# EAGLE schematic wear_fixture_board (EAGLE 9.1.3)
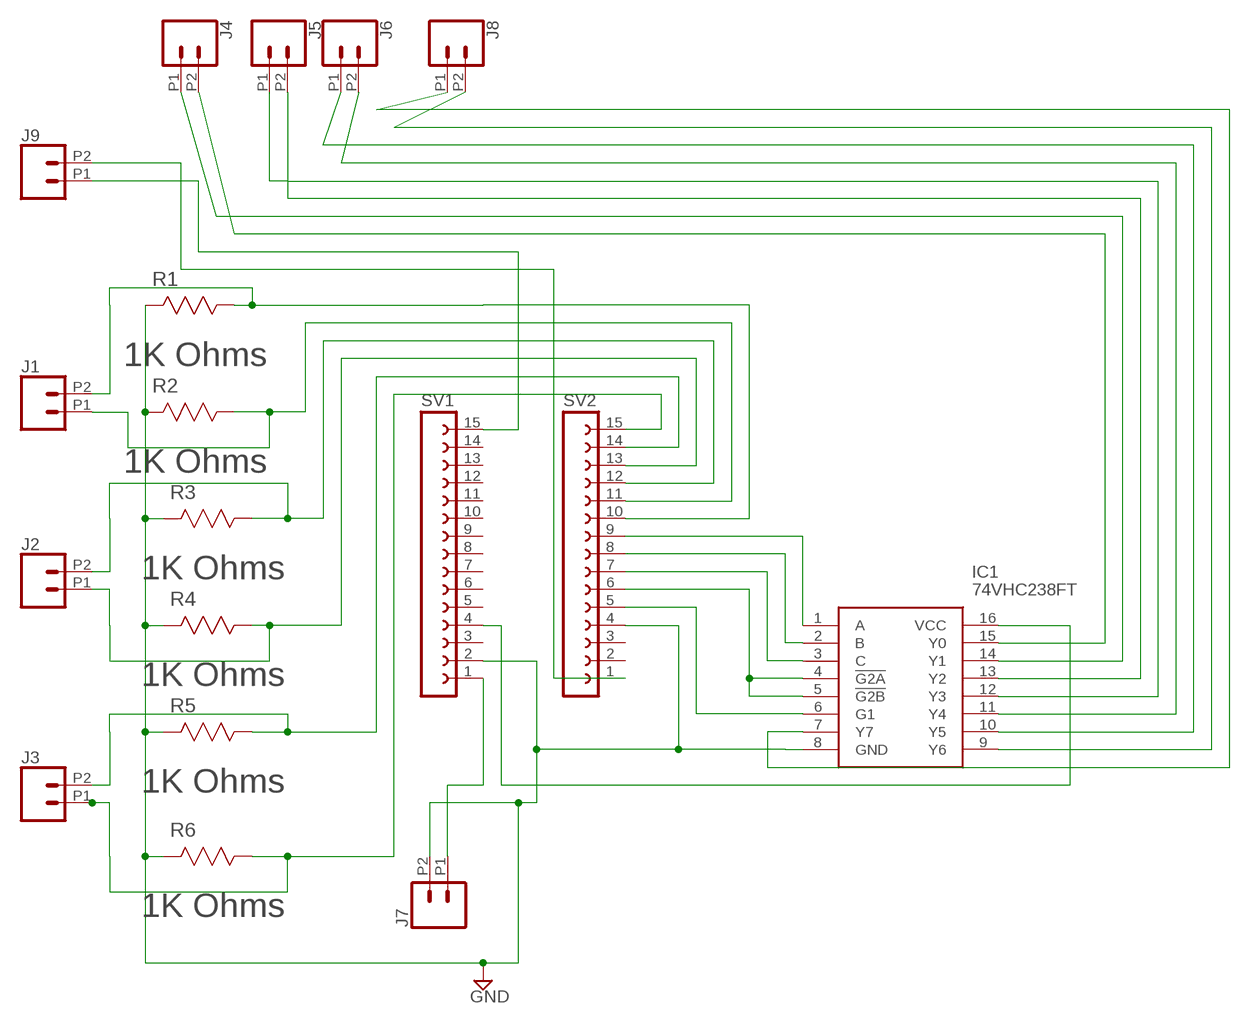
[diagram p0: schematic, sheet 1]

## Parts
IC1  74VHC238FT  [SOP65P640X120-16N]
J1  CONN_022.54MM_SCREWTERM  [1X02_2.54_SCREWTERM]
J2  CONN_022.54MM_SCREWTERM  [1X02_2.54_SCREWTERM]
J3  CONN_022.54MM_SCREWTERM  [1X02_2.54_SCREWTERM]
J4  CONN_022.54MM_SCREWTERM  [1X02_2.54_SCREWTERM]
J5  CONN_022.54MM_SCREWTERM  [1X02_2.54_SCREWTERM]
J6  CONN_022.54MM_SCREWTERM  [1X02_2.54_SCREWTERM]
J7  CONN_022.54MM_SCREWTERM  [1X02_2.54_SCREWTERM]
J8  CONN_022.54MM_SCREWTERM  [1X02_2.54_SCREWTERM]
J9  CONN_022.54MM_SCREWTERM  [1X02_2.54_SCREWTERM]
R1  1K Ohms  CRCW12061K00FKEA  [RESC3216X71N]
R2  1K Ohms  CRCW12061K00FKEA  [RESC3216X71N]
R3  1K Ohms  CRCW12061K00FKEA  [RESC3216X71N]
R4  1K Ohms  CRCW12061K00FKEA  [RESC3216X71N]
R5  1K Ohms  CRCW12061K00FKEA  [RESC3216X71N]
R6  1K Ohms  CRCW12061K00FKEA  [RESC3216X71N]
SV1  FE15-1  [FE15]
SV2  FE15-1  [FE15]

## Nets
GND: IC1.8(GND) J7.P2 R1.2 R2.2 R3.2 R4.2 R5.2 R6.2 SV1.2 SV2.4
N$1: J3.P1 R6.1 SV2.15
N$2: J1.P2 R1.1 SV2.10
N$3: J2.P2 R3.1 SV2.12
N$4: J2.P1 R4.1 SV2.13
N$5: J3.P2 R5.1 SV2.14
N$11: J1.P1 R2.1 SV2.11
N$12: IC1.1(A) SV2.9
N$13: IC1.2(B) SV2.8
N$14: IC1.3(C) SV2.7
N$15: IC1.4(!G2A) IC1.5(!G2B) SV2.6
N$16: IC1.11(Y4) J6.P2
N$17: IC1.6(G1) SV2.5
N$18: IC1.16(VCC) SV1.4
N$19: IC1.10(Y5) J6.P1
N$20: IC1.15(Y0) J4.P2
N$21: IC1.14(Y1) J4.P1
N$22: IC1.13(Y2) J5.P2
N$23: IC1.12(Y3) J5.P1
N$24: IC1.9(Y6) J8.P2
N$25: IC1.7(Y7) J8.P1
N$26: J9.P2 SV2.1
N$27: J9.P1 SV1.15
N$28: J7.P1 SV1.1
Unconnected: SV1.3 SV1.5 SV1.6 SV1.7 SV1.8 SV1.9 SV1.10 SV1.11 SV1.12 SV1.13 SV1.14 SV2.2 SV2.3

## Library data of the parts
IC1 = SamacSys_Parts:74VHC238FT: Encoders, Decoders, Multiplexers & Demultiplexers CMOS Logic IC 5.5ns 8mA 2.0V-5.5V Source: Datasheet; DESCRIPTION: Encoders, Decoders, Multiplexers & Demultiplexers CMOS Logic IC 5.5ns 8mA 2.0V-5.5V; HEIGHT: 1.2mm; MANUFACTURER_NAME: Toshiba; MANUFACTURER_PART_NUMBER: 74VHC238FT; MOUSER_PART_NUMBER: 757-74VHC238FT; MOUSER_PRICE-STOCK: https://www.mouser.co.uk/ProductDetail/Toshiba/74VHC238FT?qs=byeeYqUIh0Pl5hUxTthlPw%3D%3D
J1-J9 = SparkFun-Connectors:CONN_02: Multi connection point. Often used as Generic Header-pin footprint for 0.1 inch spaced/style header connections On any of the 0.1 inch spaced packages, you can populate with these: Break Away Headers - Straight <https://www.sparkfun.com/products/116> (PRT-00116) Break Away Male Headers - Right Angle <https://www.sparkfun.com/products/553> (PRT-00553) Female Headers <https://www.sparkfun.com/products/115> (PRT-00115) Break Away Headers - Machine Pin <https://www.sparkfun.com/products/117> (PRT-00117) Break Away Female Headers - Swiss Machine Pin <https://www.sparkfun.com/products/743> (PRT-00743) For SCREWTERMINALS and SPRING TERMINALS visit here: Screw Terimnals on SparkFun.com <https://www.sparkfun.com/search/results?term=Screw+Terminals> (5mm/3.5mm/2.54mm spacing) This device is also useful as a general connection point to wire up your design to another part of your project. Our various solder wires solder well into these plated through hole pads. Hook-Up Wire - Assortment (Stranded, 22 AWG) <https://www.sparkfun.com/products/11375> (PRT-11375) Hook-Up Wire - Assortment (Solid Core, 22 AWG) <https://www.sparkfun.com/products/11367> (PRT-11367) View the entire wire category on our website here <https://www.sparkfun.com/categories/141> Special notes: Molex polarized connector foot print use with: PRT-08233 with associated crimp pins and housings. 2.54_SCREWTERM for use with PRT-10571. 3.5mm Screw Terminal footprints for PRT-08084 5mm Screw Terminal footprints for use with PRT-08432
R1-R6 = Vishay_By_element14_Batch_1:CRCW12061K00FKEA: RESISTOR, 1206; MPN: CRCW12061K00FKEA; OC_FARNELL: 1469965; OC_NEWARK: 53K1780; SUPPLIER: Vishay; TOLERANCE: ±1%; WATTAGE: 0.25W
SV1 SV2 = con-lsta:FE15-1: FEMALE HEADER; OC_FARNELL: unknown; OC_NEWARK: unknown